# EAGLE design Lipmouse_Teensy (EAGLE 6.5.0)
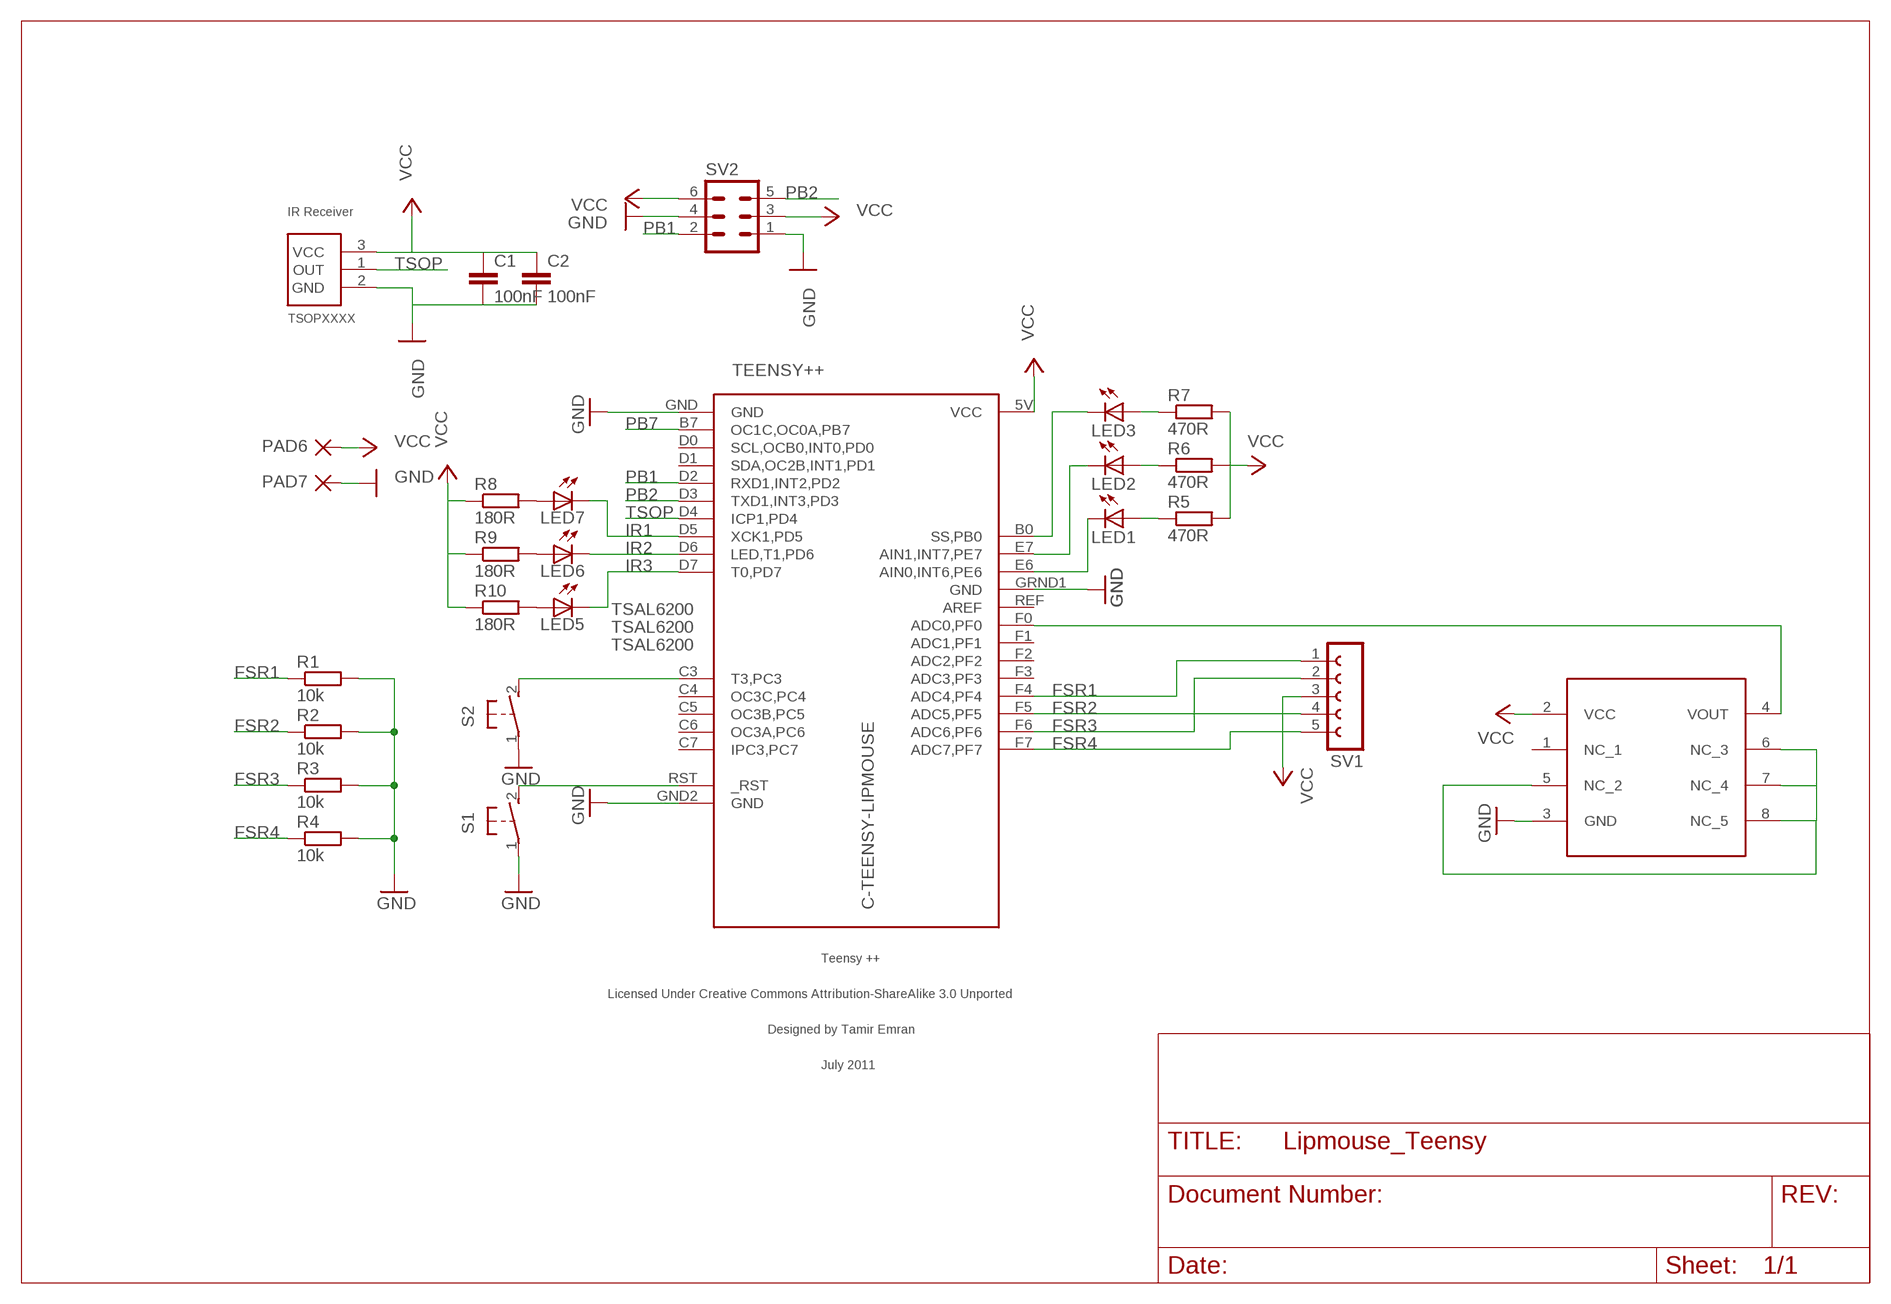
[diagram p0: schematic, sheet 1]

## Parts
C1  100nF  C-EUC0805K  [C0805K]
C2  100nF  C-EUC0805K  [C0805K]
LED1  LED3MM  [LED3MM]
LED2  LED3MM  [LED3MM]
LED3  LED3MM  [LED3MM]
LED5  TSAL6200  LED5MM  [LED5MM]
LED6  TSAL6200  LED5MM  [LED5MM]
LED7  TSAL6200  LED5MM  [LED5MM]
PAD6  1,6/0,9  [1,6/0,9]
PAD7  1,6/0,9  [1,6/0,9]
R1  10k  R-EU_R0805W  [R0805W]
R2  10k  R-EU_R0805W  [R0805W]
R3  10k  R-EU_R0805W  [R0805W]
R4  10k  R-EU_R0805W  [R0805W]
R5  470R  R-EU_R0805W  [R0805W]
R6  470R  R-EU_R0805W  [R0805W]
R7  470R  R-EU_R0805W  [R0805W]
R8  180R  R-EU_R0805W  [R0805W]
R9  180R  R-EU_R0805W  [R0805W]
R10  180R  R-EU_R0805W  [R0805W]
S1  31-XX  [B3F-31XX]
S2  31-XX  [B3F-31XX]
SV1  FE05-1  [FE05-1]
SV2  ML6  [ML6]
TEENSY++  C-TEENSY-LIPMOUSE  [TEENSY++]
U$2  MP3V7007GP  [SMP_MP3V7007]
U$3  TSOP4838  TSOP48XX  [TSOP2XXX]

## Nets
FSR1: R1.1 SV1.1 TEENSY++.F4(ADC4,PF4)
FSR2: R2.1 SV1.4 TEENSY++.F5(ADC5,PF5)
FSR3: R3.1 SV1.2 TEENSY++.F6(ADC6,PF6)
FSR4: R4.1 SV1.5 TEENSY++.F7(ADC7,PF7)
GND: C1.2 C2.2 PAD7.1(P) R1.2 R2.2 R3.2 R4.2 S1.1(P) S2.1(P) SV2.1 SV2.4 TEENSY++.GND TEENSY++.GND2(GND) TEENSY++.GRND1(GND) U$2.3(GND) U$3.2(GND)
IR1: LED7.K(C) TEENSY++.D5(XCK1,PD5)
IR2: LED6.K(C) TEENSY++.D6(LED,T1,PD6)
IR3: LED5.K(C) TEENSY++.D7(T0,PD7)
N$1: LED1.A R5.1
N$2: LED2.A R6.1
N$3: LED3.A R7.1
N$5: S2.2(S) TEENSY++.C3(T3,PC3)
N$6: LED1.K(C) TEENSY++.E6(AIN0,INT6,PE6)
N$7: TEENSY++.F0(ADC0,PF0) U$2.4(VOUT)
N$8: LED2.K(C) TEENSY++.E7(AIN1,INT7,PE7)
N$9: LED3.K(C) TEENSY++.B0(SS,PB0)
N$10: LED7.A R8.2
N$11: LED6.A R9.2
N$12: LED5.A R10.2
N$14: U$2.5(NC_2) U$2.6(NC_3) U$2.7(NC_4) U$2.8(NC_5)
N$17: S1.2(S) TEENSY++.RST(_RST)
PB1: SV2.2 TEENSY++.D2(RXD1,INT2,PD2)
PB2: SV2.5 TEENSY++.D3(TXD1,INT3,PD3)
PB7: TEENSY++.B7(OC1C,OC0A,PB7)
TSOP: TEENSY++.D4(ICP1,PD4) U$3.1(OUT)
VCC: C1.1 C2.1 PAD6.1(P) R5.2 R6.2 R7.2 R8.1 R9.1 R10.1 SV1.3 SV2.3 SV2.6 TEENSY++.5V(VCC) U$2.2(VCC) U$3.3(VCC)
Unconnected: TEENSY++.C4(OC3C,PC4) TEENSY++.C5(OC3B,PC5) TEENSY++.C6(OC3A,PC6) TEENSY++.C7(IPC3,PC7) TEENSY++.D0(SCL,OCB0,INT0,PD0) TEENSY++.D1(SDA,OC2B,INT1,PD1) TEENSY++.F1(ADC1,PF1) TEENSY++.F2(ADC2,PF2) TEENSY++.F3(ADC3,PF3) TEENSY++.REF(AREF) U$2.1(NC_1)

## Library data of the parts
C1 C2 = resistor:C-EU: CAPACITOR, European symbol
LED1-LED3 = adafruit:LED: LED
LED5-LED7 = led:LED: LED
PAD6 PAD7 = wirepad:1,6/0,9: THROUGH-HOLE PAD
R1-R10 = resistor:R-EU_: RESISTOR, European symbol
S1 S2 = adafruit:31-XX: OMRON SWITCH Now with beefier pads!
SV1 = con-lsta:FE05-1: FEMALE HEADER; OC_FARNELL: unknown; OC_NEWARK: unknown
SV2 = con-harting-ml:ML6: HARTING; OC_FARNELL: unknown; OC_NEWARK: unknown
TEENSY++ = teensy_lipmouse:C-TEENSY-LIPMOUSE
U$2 = libMP3V7007GP:MP3V7007GP
U$3 = TSOPXXXX:TSOP48XX

## Board
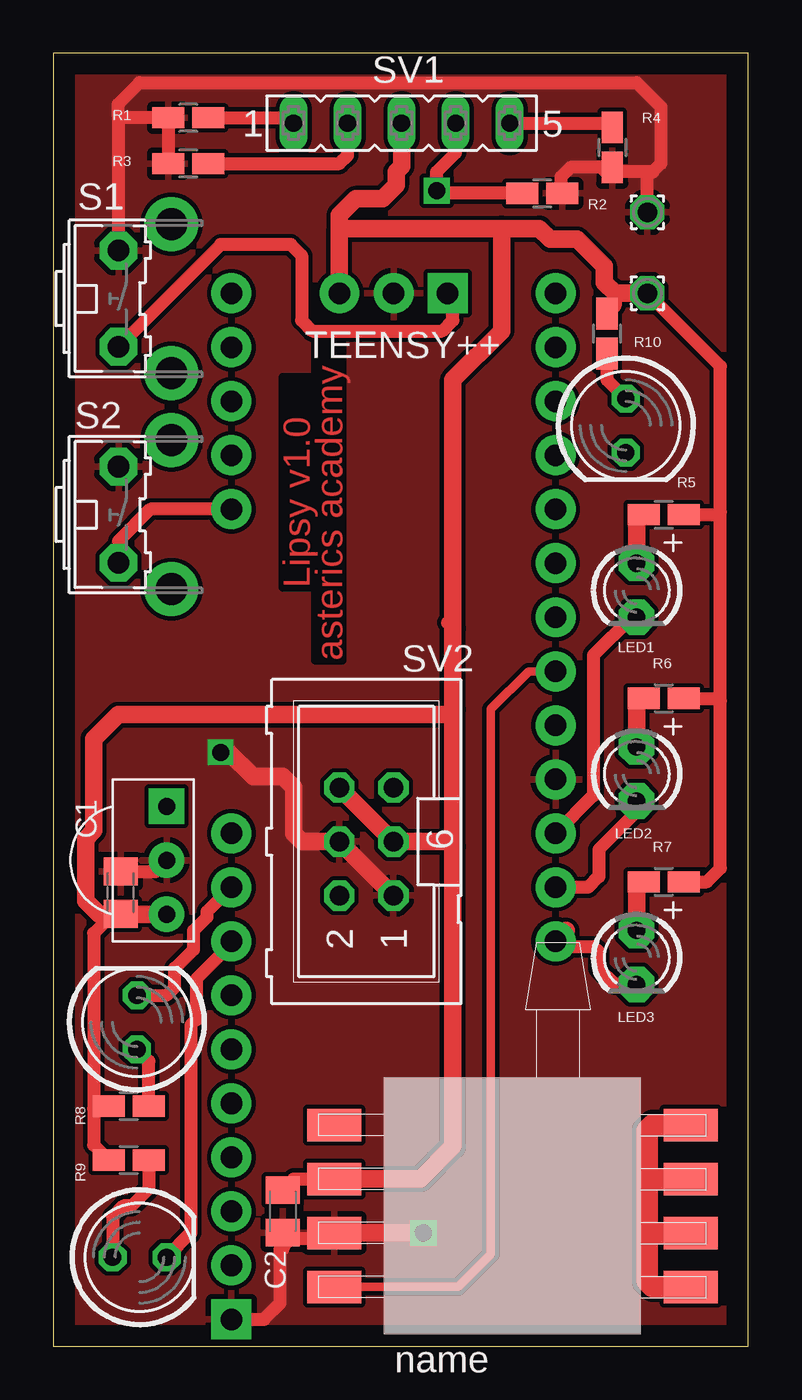
[diagram p1: board, top side]
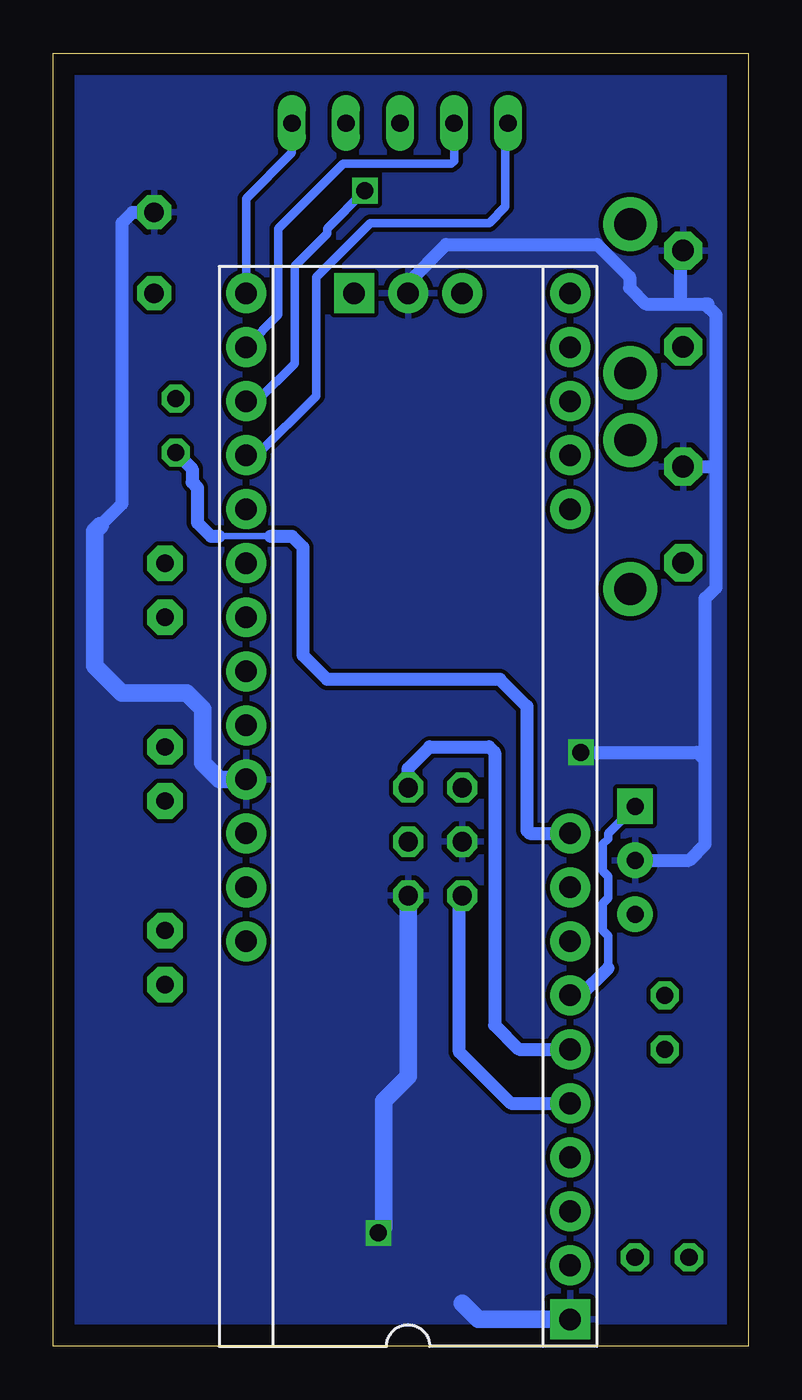
[diagram p2: board, bottom side, seen from below]

Size 32.69 x 60.82 mm. Coordinates in mm from the lower left corner, seen from the top.
Outline: 0,0 32.69,0 32.69,60.82 0,60.82 0,0
Copper layers (1*16): Top 0.035mm / dielectric 1.5mm / Bottom 0.035mm
Design rules "default *": minimum track width 10mil, minimum drill 24mil, track to track 8mil, track to pad 8mil, pad to pad 8mil, via to via 8mil, smd to smd 8mil, copper to edge 40mil, drill to drill 8mil, minimum pad ring 10mil, minimum via ring 8mil, stop-mask expansion 2mil, vias tented up to drill 0mil, thermal gap 10mil

### Footprints (pad centres in the part's own frame; a part is rotated, then mirrored left to right if it is on the bottom)
C0805K = smd 1.3 x 1.6: 1 -1,0; 2 1,0
LED3MM = drill 0.813 pad 1.676 octagon: A -1.27,0; K 1.27,0
LED5MM = drill 0.813 octagon: A -1.27,0; K 1.27,0
1,6/0,9 = drill 0.914 pad 1.6 octagon: 1 0,0
R0805W = smd 1.5 x 1: 1 -0.94,0; 2 0.94,0
B3F-31XX = drill 1.016 pad 1.778 octagon: 1 -2.261,-1.245; 2 2.261,-1.245 | drill 1.499 pad 2.54: 3 -3.505,1.245; 4 3.505,1.245
FE05-1 = drill 0.813 long: 1 -5.08,0; 2 -2.54,0; 3 0,0; 4 2.54,0; 5 5.08,0
ML6 = drill 0.914 octagon: 1 -2.54,-1.27; 2 -2.54,1.27; 3 0,-1.27; 4 0,1.27; 5 2.54,-1.27; 6 2.54,1.27
TEENSY++ = drill 1.016 pad 1.88: 5V 24.13,-2.54; B0 -6.35,7.62; B7 -21.59,-7.62; C3 13.97,-7.62; C4 16.51,-7.62; C5 19.05,-7.62; C6 21.59,-7.62; C7 24.13,-7.62; D0 -19.05,-7.62; D1 -16.51,-7.62; D2 -13.97,-7.62; D3 -11.43,-7.62; D4 -8.89,-7.62; D5 -6.35,-7.62; D6 -3.81,-7.62; D7 -1.27,-7.62; E6 -1.27,7.62; E7 -3.81,7.62; F0 6.35,7.62; F1 8.89,7.62; F2 11.43,7.62; F3 13.97,7.62; F4 16.51,7.62; F5 19.05,7.62; F6 21.59,7.62; F7 24.13,7.62; GND2 24.13,0; GRND1 1.27,7.62; REF 3.81,7.62 | drill 1.016 pad 1.88 square: GND -24.13,-7.62; RST 24.13,2.54
SMP_MP3V7007 = smd 2.54 x 1.524: 1 8.382,-3.81; 2 8.382,-1.27; 3 8.382,1.27; 4 8.382,3.81; 5 -8.382,3.81; 6 -8.382,1.27; 7 -8.382,-1.27; 8 -8.382,-3.81
TSOP2XXX = drill 0.8 pad 1.676 square: 1 -2.54,0 | drill 0.8 pad 1.676: 2 0,0; 3 2.54,0

### Placement (x,y rotation side)
C1  3.17,21.34 90 top
C2  10.79,6.35 270 top
LED1  27.43,35.56 270 top
LED2  27.43,26.92 270 top
LED3  27.43,18.29 270 top
LED5  26.92,43.31 270 top
LED6  3.94,15.24 90 top
LED7  4.06,4.19 0 top
PAD6  27.94,49.53 0 top
PAD7  27.94,53.34 0 top
R1  6.35,57.78 180 top
R2  22.99,54.23 0 top
R3  6.35,55.63 180 top
R4  26.29,56.39 270 top
R5  28.7,39.12 0 top
R6  28.7,30.48 0 top
R7  28.7,21.84 0 top
R8  3.56,8.76 0 top
R9  3.56,11.3 0 top
R10  26.04,47.62 270 top
S1  4.32,49.28 270 top
S2  4.32,39.12 270 top
SV1  16.38,57.53 0 top
SV2  14.73,23.74 90 top
TEENSY++  16,25.4 90 bottom
U$2  21.59,6.6 180 top
U$3  5.33,22.86 270 top

### Tracks (layer width: path | path; a pad name or v marks a point on that pad's centre or on a via)
FSR1
  Top 0.61: R1.1 11.05,57.78 SV1.1
  Bottom 0.406: TEENSY++.F4 23.11,41.91 20.32,44.7 20.32,50.29 17.78,52.83 12.19,52.83 11.43,53.59 11.43,57.4 SV1.1
FSR2  (via drill 0.8)
  Top 0.61: SV1.4 18.92,56.13 18.03,55.24 v18.03,54.36 18.16,54.23 R2.1
  Bottom 0.406: TEENSY++.F5 23.11,44.45 21.34,46.23 21.34,50.8 19.81,52.32 19.81,52.58 v18.03,54.36
FSR3
  Top 0.61: R3.1 13.46,55.63 13.84,56.01 SV1.2
  Bottom 0.406: TEENSY++.F6 22.1,48.51 22.1,52.58 19.05,55.63 13.97,55.63 13.84,55.75 SV1.2
FSR4
  Top 0.61: SV1.5 26.09,57.53 R4.1
  Bottom 0.406: TEENSY++.F7 23.62,53.98 21.46,56.13 SV1.5
GND  (via drill 0.8)
  Top 0.61: TEENSY++.GND 9.91,1.27 10.67,2.03 10.67,4.45 | 10.67,4.45 10.67,4.57 11.18,5.08 12.95,5.08 U$2.3 | 3.05,57.91 3.05,51.56 S1.1 | C2.2 10.79,4.57 10.67,4.45 | C1.2 4.81,22.34 U$3.2 | 5.41,56.01 R3.2 R1.2 3.17,57.78 3.05,57.91 | R4.2 25.78,55.45 | 25.78,55.45 24.33,55.45 23.88,54.99 23.88,54.28 R2.2 | 27.94,55.24 28.19,55.24 28.57,55.63 28.57,58.29 27.43,59.44 4.06,59.44 3.05,58.42 3.05,57.91 | 27.94,55.24 25.98,55.24 25.78,55.45 | PAD7.1 27.94,55.24
  Top 0.813: v7.87,27.94 8.26,27.94 9.4,26.8 10.79,26.8 11.3,26.29 11.3,24.13 11.68,23.75 13.45,23.75 SV2.4 SV2.1 | v17.4,5.33 U$2.3
  Bottom 0.61: 15.75,49.28 TEENSY++.GND2 16,50.04 14.22,51.82 7.11,51.82 5.59,50.29 5.59,49.78 4.83,49.02 3.17,49.02 | PAD7.1 28.96,53.34 29.46,52.83 29.46,39.62 30.48,38.61 | U$3.2 2.79,22.86 2.03,23.62 2.03,27.56 | v7.87,27.94 2.41,27.94 2.03,27.56 | 3.17,49.02 2.03,49.02 | 2.03,49.02 1.91,49.02 | 2.03,27.56 2.03,35.18 1.52,35.69 1.52,41.15 | 1.52,41.15 1.52,48.51 2.03,49.02 | S2.1 1.75,41.38 1.52,41.15 | 3.17,49.02 3.17,51.44 S1.1
  Bottom 0.813: TEENSY++.GRND1 24.89,26.67 25.65,27.43 25.65,29.97 26.42,30.73 29.46,30.73 30.73,32 30.73,38.35 30.48,38.61 | 13.46,2.03 12.7,1.27 TEENSY++.GND | SV2.1 16,12.71 17.14,11.56 17.14,5.59 v17.4,5.33
  pour Top: 0,60.83 32.77,60.83 32.77,0 0,0
  pour Bottom: 0,60.83 32.77,60.83 32.77,0 0,0
IR1
  Top 0.61: TEENSY++.D5 8.38,18.92 6.73,17.27 6.73,15.37 6.48,15.11 6.48,5.33 LED7.K
IR2
  Top 0.61: LED6.K 5.33,16.51 5.71,16.89 5.71,17.78 6.6,18.67 6.6,19.56 7.24,20.19 7.24,20.45 TEENSY++.D6
IR3
  Bottom 0.305: 24.89,38.1 22.48,38.1
  Bottom 0.61: LED5.K 26.16,41.27 26.16,40.64 25.91,40.39 25.91,38.73 25.27,38.1 24.89,38.1 | 22.48,38.1 21.46,38.1 20.95,37.59 20.95,32.51 19.81,31.37 11.68,31.37 10.41,30.1 10.41,24.26 10.29,24.13 TEENSY++.D7
N$1
  Top 0.813: LED1.A 27.43,38.79 R5.1
N$2
  Top 0.813: LED2.A 27.43,30.15 R6.1
N$3
  Top 0.813: LED3.A 27.43,21.51 R7.1
N$5
  Top 0.61: TEENSY++.C3 4.57,39.37 3.07,37.87 S2.2
N$6
  Top 0.61: LED1.K 27.18,34.29 25.4,32.51 25.4,25.91 TEENSY++.E6
N$7
  Top 0.406: TEENSY++.F0 22.35,31.75 20.57,29.97 20.57,4.32 19.05,2.79 U$2.4
N$8
  Top 0.61: LED2.K 27.43,25.15 25.65,23.37 25.65,22.1 25.15,21.59 TEENSY++.E7
N$9
  Top 0.61: LED3.K 26.42,17.02 25.65,17.78 25.65,18.54 25.4,18.8 23.88,18.8 TEENSY++.B0
  Top 0.813: 24.13,19.56 TEENSY++.B0
N$10
  Top 0.61: R8.2 4.5,7.42 3.68,6.6 3.3,6.6 2.79,6.1 LED7.A
N$11
  Top 0.61: R9.2 4.5,13.41 LED6.A
N$12
  Top 0.61: R10.2 26.04,45.47 LED5.A
N$14
  Top 1.016: U$2.8 28.19,10.41 27.94,10.16 27.94,7.87 | 27.94,7.87 27.94,5.08 | 27.94,5.08 27.94,3.05 28.19,2.79 U$2.5 | U$2.6 28.19,5.33 27.94,5.08 | U$2.7 27.94,7.87
N$17
  Top 0.61: TEENSY++.RST 18.8,49.28 18.8,48.26 18.29,47.75 12.19,47.75 11.68,48.26 11.68,51.31 11.18,51.82 7.87,51.82 S1.2
PB1
  Bottom 0.61: TEENSY++.D2 11.18,11.43 13.59,13.84 13.59,21.07 SV2.2
PB2
  Bottom 0.61: SV2.5 | SV2.5 16,27.18 14.99,28.19 12.19,28.19 11.94,27.94 11.94,15.11 10.79,13.97 TEENSY++.D3 | SV2.5
TSOP
  Bottom 0.406: 6.6,17.78 6.6,19.3 6.86,19.56 6.86,20.83 6.6,21.08 6.6,22.1 6.86,22.35 6.86,23.62 6.6,23.88 6.6,24.13 U$3.1
  Bottom 0.61: TEENSY++.D4 7.87,16.51 6.6,17.78
VCC
  Top 0.61: 18.54,34.04 18.8,33.78 | 26.42,49.53 26.42,48.95 R10.1 | U$3.3 3.16,20.32 | 1.91,11.18 1.91,19.43 2.79,20.32 3.16,20.32 | 1.91,11.18 1.91,9.47 R8.1 | R9.1 2.03,11.3 1.91,11.18 | R7.2 30.73,21.84 31.37,22.48 31.37,30.35 | 31.37,30.35 31.37,39.24 | 31.37,39.24 31.37,46.1 PAD6.1 | R5.2 31.24,39.12 31.37,39.24 | R6.2 31.24,30.48 31.37,30.35 | C2.1 10.79,7.37 11.3,7.87 U$2.2 | SV1.3 16.38,56.77 | 3.16,20.32 C1.1
  Top 0.813: TEENSY++.5V 13.46,52.58 | 13.46,52.58 21.08,52.58 | 21.08,52.58 22.86,52.58 23.37,52.07 24.64,52.07 25.91,50.8 25.91,50.04 26.42,49.53 PAD6.1 | U$2.2 17.27,7.87 18.8,9.4 18.8,23.5 | 18.8,23.5 18.8,29.97 | 18.8,29.97 18.8,33.78 18.8,45.47 21.08,47.75 21.08,52.58 | U$3.3 2.79,20.32 2.16,20.32 1.52,20.95 1.52,23.88 1.91,24.26 1.91,28.57 3.05,29.72 18.54,29.72 18.8,29.97 | SV1.3 16.38,55.5 16.13,55.24 16.13,54.61 15.49,53.98 14.22,53.98 13.46,53.21 13.46,52.58 | SV2.6 SV2.3 18.55,23.74 18.8,23.5

### Text on the board
Top: Lipsy v1.0 | asterics academy